# Altium project STM32F103.PRJPCB
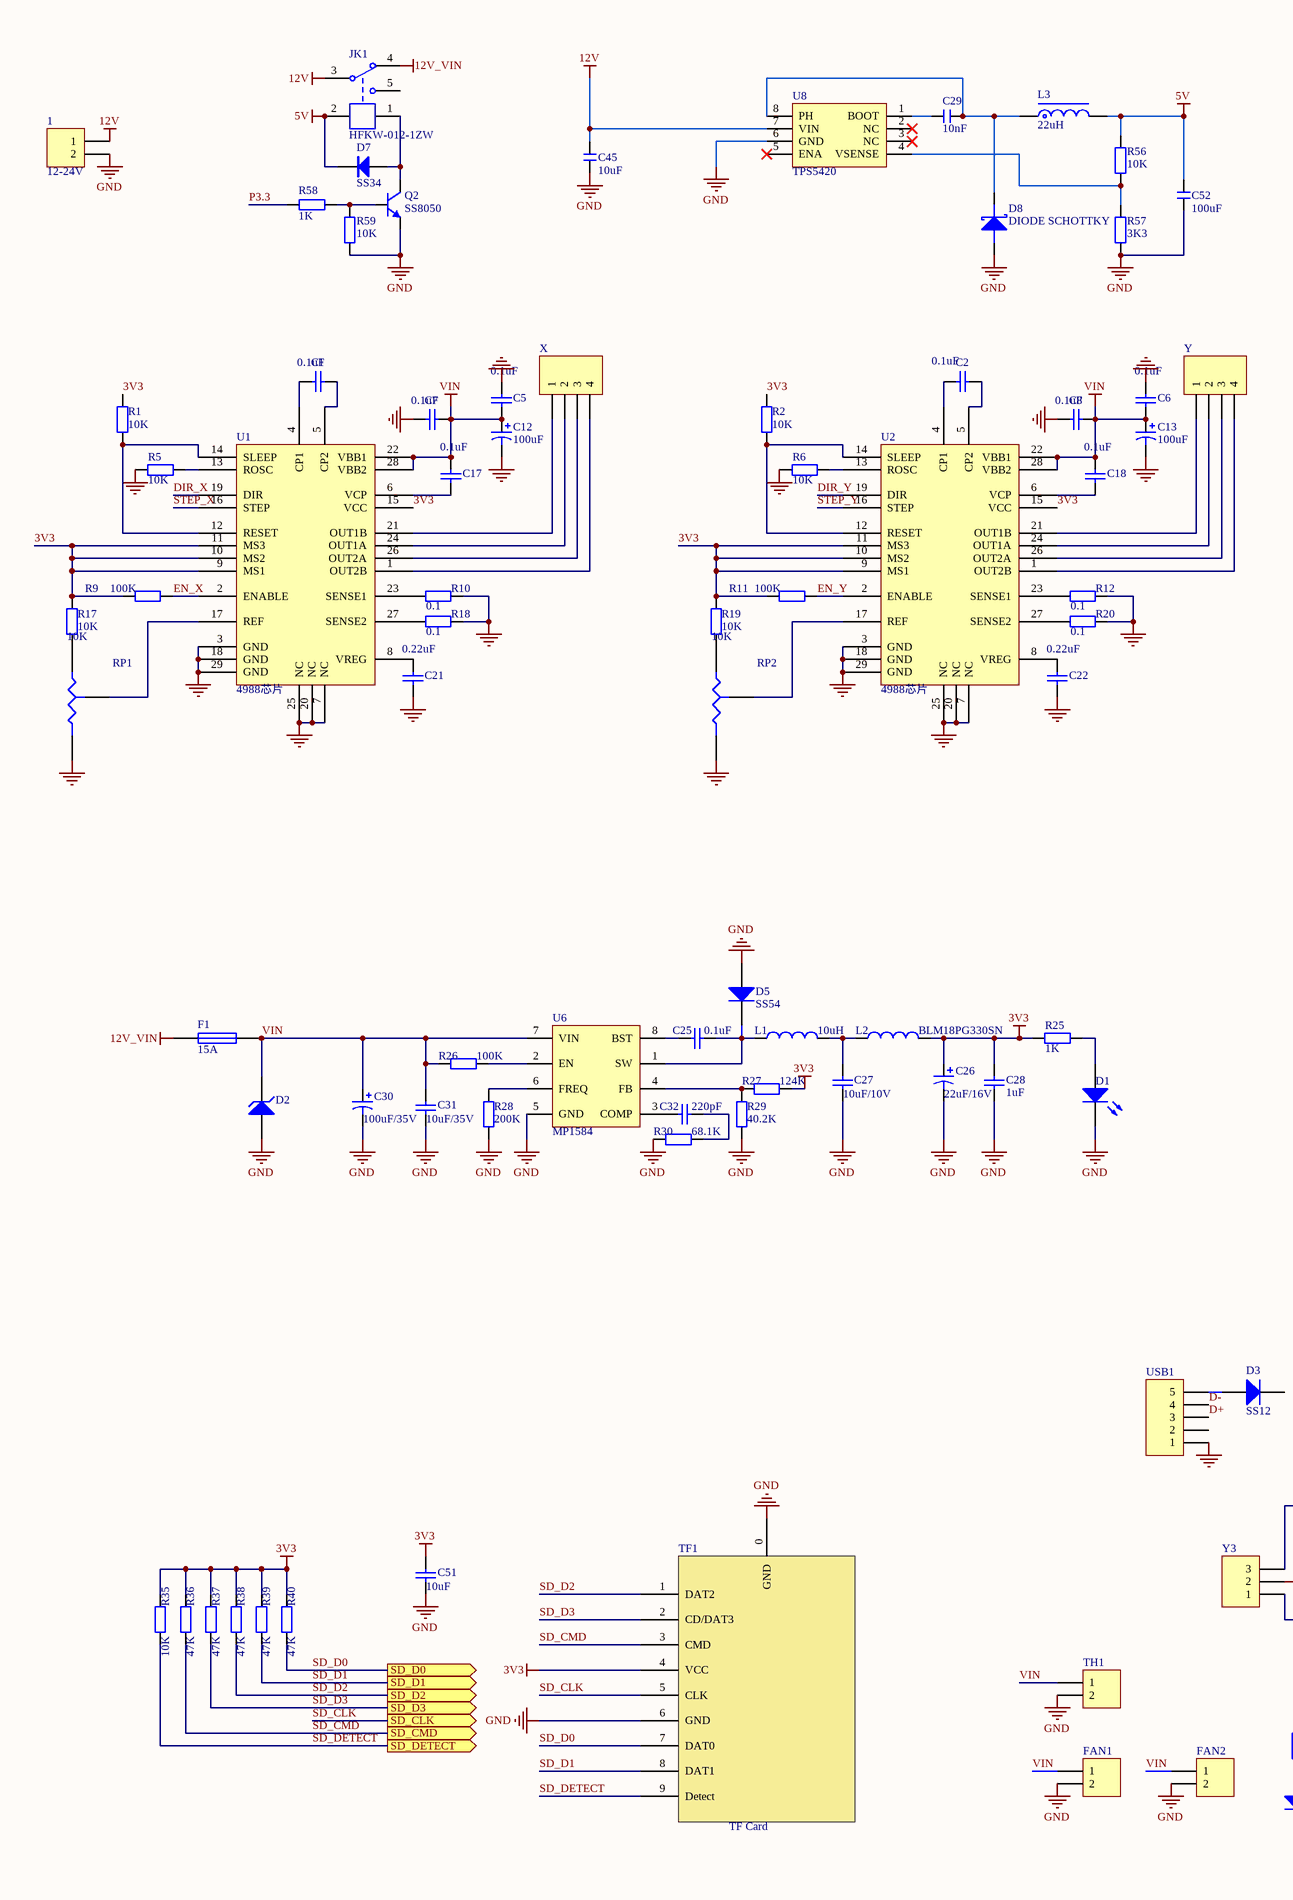
[diagram p0: STM32F103.SCHDOC, left]
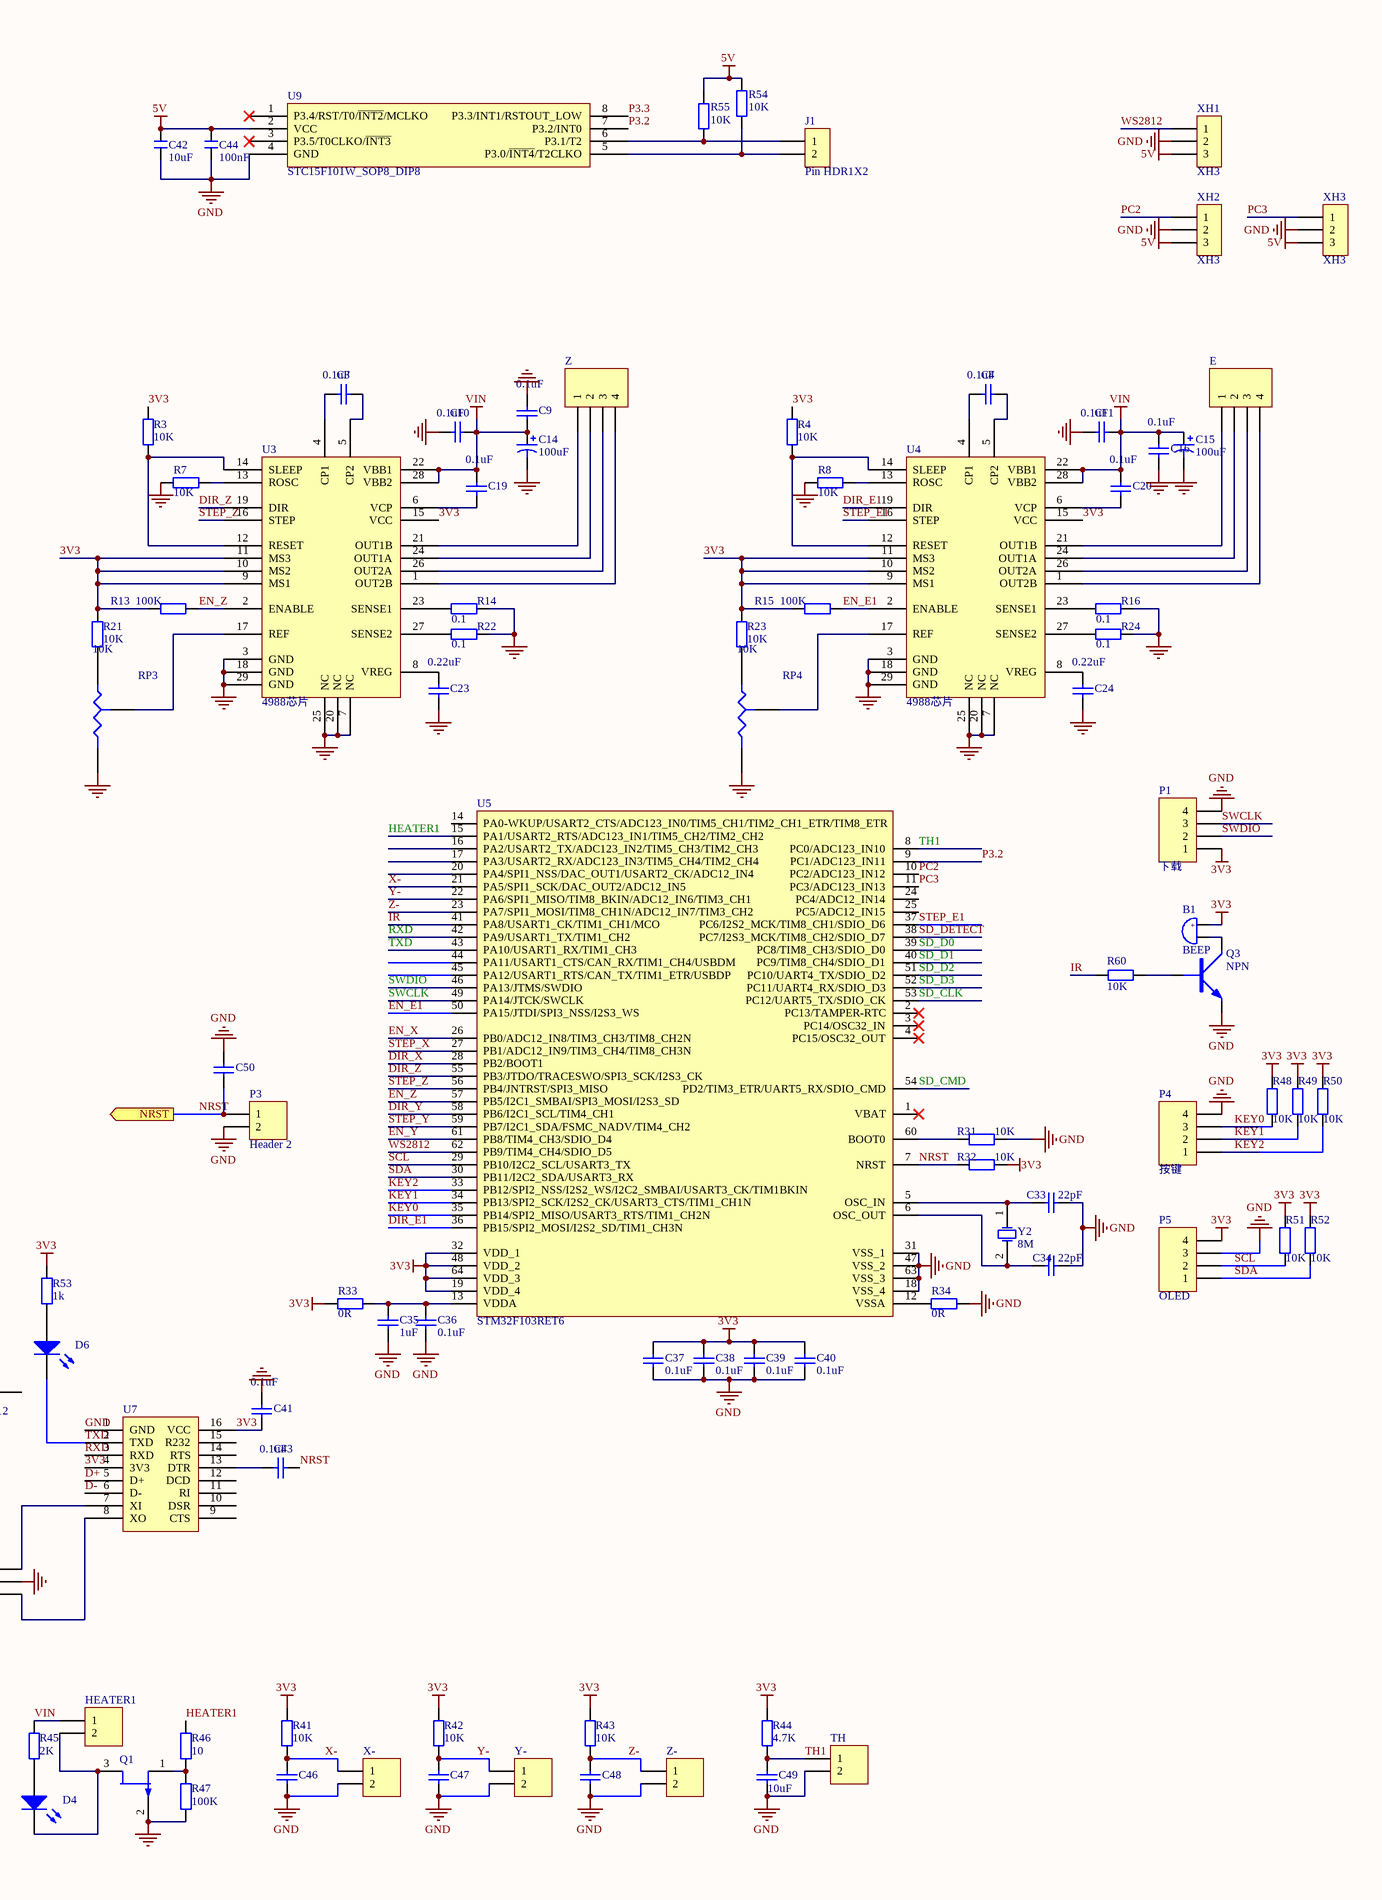
[diagram p1: STM32F103.SCHDOC, right]
1 sheet, 167 parts. Net scope: flat (ports and power ports of the same name join across sheets).
Board file: STM32F103RET6.PcbDoc

## Sheet STM32F103.SCHDOC: Motor
size A2

### Parts
1  12-24V  [VH-2P]
B1  BEEP  [BEEP 5x9x5.5]
C1  value 0.1uF  [0603]  (hidden comment: Cap)
C2  value 0.1uF  [0603]  (hidden comment: Cap)
C3  value 0.1uF  [0603]  (hidden comment: Cap)
C4  value 0.1uF  [0603]  (hidden comment: Cap)
C5  value 0.1uF  [0603]  (hidden comment: Cap)
C6  value 0.1uF  [0603]  (hidden comment: Cap)
C7  value 0.1uF  [0603]  (hidden comment: Cap)
C8  value 0.1uF  [0603]  (hidden comment: Cap)
C9  value 0.1uF  [0603]  (hidden comment: Cap)
C10  value 0.1uF  [0603]  (hidden comment: Cap)
C11  value 0.1uF  [0603]  (hidden comment: Cap)
C12  value 100uF  [电容100nf35V]  (hidden comment: Cap Pol1)
C13  value 100uF  [电容100nf35V]  (hidden comment: Cap Pol1)
C14  value 100uF  [电容100nf35V]  (hidden comment: Cap Pol1)
C15  value 100uF  [电容100nf35V]  (hidden comment: Cap Pol1)
C16  value 0.1uF  [0603]  (hidden comment: Cap)
C17  value 0.1uF  [0603]  (hidden comment: Cap)
C18  value 0.1uF  [0603]  (hidden comment: Cap)
C19  value 0.1uF  [0603]  (hidden comment: Cap)
C20  value 0.1uF  [0603]  (hidden comment: Cap)
C21  value 0.22uF  [0603]  (hidden comment: Cap)
C22  value 0.22uF  [0603]  (hidden comment: Cap)
C23  value 0.22uF  [0603]  (hidden comment: Cap)
C24  value 0.22uF  [0603]  (hidden comment: Cap)
C25  value 0.1uF  [0603]  (hidden comment: Cap)
C26  value 22uF/16V  [TAN-A]  (hidden comment: Cap Pol1)
C27  value 10uF/10V  [0805]  (hidden comment: Cap)
C28  value 1uF  [0603]  (hidden comment: Cap)
C29  10nF  [C 0603_L]
C30  value 100uF/35V  [电容100nf35V]  (hidden comment: Cap Pol1)
C31  value 10uF/35V  [0805]  (hidden comment: Cap)
C32  value 220pF  [0603]  (hidden comment: Cap)
C33  value 22pF  [0603]  (hidden comment: Cap)
C34  value 22pF  [0603]  (hidden comment: Cap)
C35  value 1uF  [0603]  (hidden comment: Cap)
C36  value 0.1uF  [0603]  (hidden comment: Cap)
C37  value 0.1uF  [0603]  (hidden comment: Cap)
C38  value 0.1uF  [0603]  (hidden comment: Cap)
C39  value 0.1uF  [0603]  (hidden comment: Cap)
C40  value 0.1uF  [0603]  (hidden comment: Cap)
C41  value 0.1uF  [0603]  (hidden comment: Cap)
C42  10uF  [C 0603_L]
C43  value 0.1uF  [0603]  (hidden comment: Cap)
C44  100nF  [C 0603_L]
C45  10uF  [C 0603_L]
C46  Cap  [0603]  (value not drawn)
C47  Cap  [0603]  (value not drawn)
C48  Cap  [0603]  (value not drawn)
C49  value 10uF  [0805]  (hidden comment: Cap)
C50  Cap  [0603]  (value not drawn)
C51  value 10uF  [0805]  (hidden comment: Cap)
C52  100uF  [C 0805_L]
D1  LED1  [LED-0603贴片]  (value not drawn)
D2  SMAJ33A  [SMA - duplicate]  (value not drawn)
D3  SS12  [SMA - duplicate]
D4  LED2  [LED-0603贴片]  (value not drawn)
D5  SS54  [SMA - duplicate]
D6  LED2  [LED-0603贴片]  (value not drawn)
D7  SS34  [SMB]
D8  DIODE SCHOTTKY  [SOD-123]
E  MHDR1X4  [2.54mm4pin]  (value not drawn)
F1  15A  [1206]
FAN1  Header 2  [2.54mm2pin]  (value not drawn)
FAN2  Header 2  [2.54mm2pin]  (value not drawn)
HEATER1  Header 2  [VH-2P]  (value not drawn)
J1  Pin HDR1X2  [Pin HDR1X2/2.54mm-S]
JK1  HFKW-012-1ZW  [012-1ZW_W]
L1  value 10uH  [5*5mm]  (hidden comment: Inductor)
L2  value BLM18PG330SN  [0603]  (hidden comment: Inductor)
L3  22uH  [CD54]
P1  下载  [HDR1X4]
P3  Header 2  [HDR1X2]
P4  按键  [2.54mm4pin]
P5  OLED  [2.54mm4pin]
Q1  JFET-P  [加热控制]  (value not drawn)
Q2  SS8050  [SOT23-3N]
Q3  NPN  [SOT-23]
R1  value 10K  [0603]  (hidden comment: Res2)
R2  value 10K  [0603]  (hidden comment: Res2)
R3  value 10K  [0603]  (hidden comment: Res2)
R4  value 10K  [0603]  (hidden comment: Res2)
R5  value 10K  [0603]  (hidden comment: Res2)
R6  value 10K  [0603]  (hidden comment: Res2)
R7  value 10K  [0603]  (hidden comment: Res2)
R8  value 10K  [0603]  (hidden comment: Res2)
R9  value 100K  [0603]  (hidden comment: Res2)
R10  value 0.1  [0805]  (hidden comment: Res2)
R11  value 100K  [0603]  (hidden comment: Res2)
R12  value 0.1  [0805]  (hidden comment: Res2)
R13  value 100K  [0603]  (hidden comment: Res2)
R14  value 0.1  [0805]  (hidden comment: Res2)
R15  value 100K  [0603]  (hidden comment: Res2)
R16  value 0.1  [0805]  (hidden comment: Res2)
R17  value 10K  [0603]  (hidden comment: Res2)
R18  value 0.1  [0805]  (hidden comment: Res2)
R19  value 10K  [0603]  (hidden comment: Res2)
R20  value 0.1  [0805]  (hidden comment: Res2)
R21  value 10K  [0603]  (hidden comment: Res2)
R22  value 0.1  [0805]  (hidden comment: Res2)
R23  value 10K  [0603]  (hidden comment: Res2)
R24  value 0.1  [0805]  (hidden comment: Res2)
R25  value 1K  [0603]  (hidden comment: Res2)
R26  value 100K  [0603]  (hidden comment: Res2)
R27  value 124K  [0603]  (hidden comment: Res2)
R28  value 200K  [0603]  (hidden comment: Res2)
R29  value 40.2K  [0603]  (hidden comment: Res2)
R30  value 68.1K  [0603]  (hidden comment: Res2)
R31  value 10K  [0603]  (hidden comment: Res2)
R32  value 10K  [0603]  (hidden comment: Res2)
R33  value 0R  [0603]  (hidden comment: Res2)
R34  value 0R  [0603]  (hidden comment: Res2)
R35  value 10K  [0603]  (hidden comment: Res2)
R36  value 47K  [0603]  (hidden comment: Res2)
R37  value 47K  [0603]  (hidden comment: Res2)
R38  value 47K  [0603]  (hidden comment: Res2)
R39  value 47K  [0603]  (hidden comment: Res2)
R40  value 47K  [0603]  (hidden comment: Res2)
R41  value 10K  [0603]  (hidden comment: Res2)
R42  value 10K  [0603]  (hidden comment: Res2)
R43  value 10K  [0603]  (hidden comment: Res2)
R44  value 4.7K  [0603]  (hidden comment: Res2)
R45  value 2K  [0603]  (hidden comment: Res2)
R46  value 10  [0603]  (hidden comment: Res2)
R47  value 100K  [0603]  (hidden comment: Res2)
R48  value 10K  [0603]  (hidden comment: Res2)
R49  value 10K  [0603]  (hidden comment: Res2)
R50  value 10K  [0603]  (hidden comment: Res2)
R51  value 10K  [0603]  (hidden comment: Res2)
R52  value 10K  [0603]  (hidden comment: Res2)
R53  value 1k  [0603]  (hidden comment: Res2)
R54  10K  [R 0603_L]
R55  10K  [R 0603_L]
R56  10K  [R 0603_L]
R57  3K3  [R 0603_M]
R58  1K  [R 0603_L]
R59  10K  [R 0603_L]
R60  10K  [R 0603_L]
RP1  value 10K  [贴片可调电阻]  (hidden comment: Res Tap)
RP2  value 10K  [贴片可调电阻]  (hidden comment: Res Tap)
RP3  value 10K  [贴片可调电阻]  (hidden comment: Res Tap)
RP4  value 10K  [贴片可调电阻]  (hidden comment: Res Tap)
TF1  TF Card  [TF Card]
TH  Header 2  [2.54mm2pin]  (value not drawn)
TH1  Header 2  [2.54mm2pin]  (value not drawn)
U1  4988芯片  [4988芯片]
U2  4988芯片  [4988芯片]
U3  4988芯片  [4988芯片]
U4  4988芯片  [4988芯片]
U5  STM32F103RET6  [LQFP-64]
U6  MP1584  [SOP8+1]
U7  CH340G  [MSOP-16]  (value not drawn)
U8  TPS5420  [SOP8_M]
U9  STC15F101W_SOP8_DIP8  [SOP8]
USB1  Header 5  [USB接口]  (value not drawn)
X  MHDR1X4  [2.54mm4pin]  (value not drawn)
X-  Header 2  [2.54mm2pin]  (value not drawn)
XH1  XH3  [XH3/2.54mm/180]
XH2  XH3  [XH3/2.54mm/180]
XH3  XH3  [XH3/2.54mm/180]
Y  MHDR1X4  [2.54mm4pin]  (value not drawn)
Y2  8M  [5032-2P]
Y3  Header 3H  [三脚晶振]  (value not drawn)
Y-  Header 2  [2.54mm2pin]  (value not drawn)
Z  MHDR1X4  [2.54mm4pin]  (value not drawn)
Z-  Header 2  [2.54mm2pin]  (value not drawn)

### Ports
NRST (out), SD_CLK (out), SD_CMD (out), SD_D0 (out), SD_D1 (out), SD_D2 (out), SD_D3 (out), SD_DETECT (out)

### Nets
3V3: B1.1 C26.1 C28.1 C37.1 C38.1 C39.1 C40.1 C41.1 C51.2 L2.2 P1.1 P5.4 R1.2 R2.2 R3.2 R4.2 R9.2 R11.2 R13.2 R15.2 R17.1 R19.1 R21.1 R23.1 R25.2 R27.2 R32.2 R33.2 R35.1 R36.1 R37.1 R38.1 R39.1 R40.1 R41.2 R42.2 R43.2 R44.1 R48.2 R49.2 R50.2 R51.2 R52.2 R53.1 TF1.4(VCC) U1.9(MS1) U1.10(MS2) U1.11(MS3) U1.15(VCC) U2.9(MS1) U2.10(MS2) U2.11(MS3) U2.15(VCC) U3.9(MS1) U3.10(MS2) U3.11(MS3) U3.15(VCC) U4.9(MS1) U4.10(MS2) U4.11(MS3) U4.15(VCC) U5.19(VDD_4) U5.32(VDD_1) U5.48(VDD_2) U5.64(VDD_3) U7.4(3V3) U7.16(VCC)
5V: C42.2 C44.2 C52.2 D7.2(K) JK1.2 L3.2 R54.2 R55.2 R56.2 U9.2(VCC) XH1.3 XH2.3 XH3.3
12V: 1.1 C45.2 JK1.3 U8.7(VIN)
12V_VIN: F1.1 JK1.4
GND: 1.2 C5.2 C6.2 C7.2 C8.2 C9.2 C10.2 C11.2 C12.2 C13.2 C14.2 C15.2 C16.2 C21.2 C22.2 C23.2 C24.2 C26.2 C27.2 C28.2 C30.2 C31.2 C33.1 C34.1 C35.2 C36.2 C37.2 C38.2 C39.2 C40.2 C41.2 C42.1 C44.1 C45.1 C46.1 C47.1 C48.1 C49.1 C50.2 C51.1 C52.1 D1.2(K) D2.1(A) D5.1(A) D8.A FAN1.2 FAN2.2 P1.4 P3.2 P4.4 P5.3 Q1.2(G) Q2.2(E) Q3.E R5.2 R6.2 R7.2 R8.2 R10.2 R12.2 R14.2 R16.2 R18.2 R20.2 R22.2 R24.2 R28.1 R29.1 R30.2 R31.2 R34.1 R47.2 R57.1 R59.1 RP1.2 RP2.2 RP3.2 RP4.2 TF1.0(GND) TF1.6(GND) TH.2 TH1.2 U1.3(GND) U1.7(NC) U1.18(GND) U1.20(NC) U1.25(NC) U1.29(GND) U2.3(GND) U2.7(NC) U2.18(GND) U2.20(NC) U2.25(NC) U2.29(GND) U3.3(GND) U3.7(NC) U3.18(GND) U3.20(NC) U3.25(NC) U3.29(GND) U4.3(GND) U4.7(NC) U4.18(GND) U4.20(NC) U4.25(NC) U4.29(GND) U5.18(VSS_4) U5.31(VSS_1) U5.47(VSS_2) U5.63(VSS_3) U6.5(GND) U7.1(GND) U8.6(GND) U9.4(GND) USB1.1 X-.2 XH1.2 XH2.2 XH3.2 Y3.2 Y-.2 Z-.2
VIN: C5.1 C6.1 C7.1 C8.1 C9.1 C10.1 C11.1 C12.1 C13.1 C14.1 C15.1 C16.1 C17.1 C18.1 C19.1 C20.1 C30.1 C31.1 D2.2(K) F1.2 FAN1.1 FAN2.1 HEATER1.1 R26.1 R45.1 TH1.1 U1.22(VBB1) U1.28(VBB2) U2.22(VBB1) U2.28(VBB2) U3.22(VBB1) U3.28(VBB2) U4.22(VBB1) U4.28(VBB2) U6.7(VIN)
D+: U7.5(D+) USB1.3
D-: U7.6(D-) USB1.4
DIR_E1: U4.19(DIR) U5.36(PB15/SPI2_MOSI/I2S2_SD/TIM1_CH3N)
DIR_X: U1.19(DIR) U5.28(PB2/BOOT1)
DIR_Y: U2.19(DIR) U5.58(PB6/I2C1_SCL/TIM4_CH1)
DIR_Z: U3.19(DIR) U5.55(PB3/JTDO/TRACESWO/SPI3_SCK/I2S3_CK)
EN_E1: R15.1 U4.2(ENABLE) U5.50(PA15/JTDI/SPI3_NSS/I2S3_WS)
EN_X: R9.1 U1.2(ENABLE) U5.26(PB0/ADC12_IN8/TIM3_CH3/TIM8_CH2N)
EN_Y: R11.1 U2.2(ENABLE) U5.61(PB8/TIM4_CH3/SDIO_D4)
EN_Z: R13.1 U3.2(ENABLE) U5.57(PB5/I2C1_SMBAI/SPI3_MOSI/I2S3_SD)
HEATER1: R46.1 U5.15(PA1/USART2_RTS/ADC123_IN1/TIM5_CH2/TIM2_CH2)
IR: R60.2 U5.41(PA8/USART1_CK/TIM1_CH1/MCO)
KEY0: P4.3 R48.1 U5.35(PB14/SPI2_MISO/USART3_RTS/TIM1_CH2N)
KEY1: P4.2 R49.1 U5.34(PB13/SPI2_SCK/I2S2_CK/USART3_CTS/TIM1_CH1N)
KEY2: P4.1 R50.1 U5.33(PB12/SPI2_NSS/I2S2_WS/I2C2_SMBAI/USART3_CK/TIM1BKIN)
NRST: C43.1 C50.1 P3.1 R32.1 U5.7(NRST) ; port NRST
P3.2: U5.9(PC1/ADC123_IN11) U9.7(P3.2/INT0)
P3.3: R58.2 U9.8(P3.3/INT1/RSTOUT_LOW)
PC2: U5.10(PC2/ADC123_IN12) XH2.1
PC3: U5.11(PC3/ADC123_IN13) XH3.1
RXD: U5.42(PA9/USART1_TX/TIM1_CH2) U7.3(RXD)
SCL: P5.2 R51.1 U5.29(PB10/I2C2_SCL/USART3_TX)
SD_CLK: TF1.5(CLK) U5.53(PC12/UART5_TX/SDIO_CK) ; port SD_CLK
SD_CMD: R36.2 TF1.3(CMD) U5.54(PD2/TIM3_ETR/UART5_RX/SDIO_CMD) ; port SD_CMD
SD_D0: R40.2 TF1.7(DAT0) U5.39(PC8/TIM8_CH3/SDIO_D0) ; port SD_D0
SD_D1: R39.2 TF1.8(DAT1) U5.40(PC9/TIM8_CH4/SDIO_D1) ; port SD_D1
SD_D2: R38.2 TF1.1(DAT2) U5.51(PC10/UART4_TX/SDIO_D2) ; port SD_D2
SD_D3: R37.2 TF1.2(CD/DAT3) U5.52(PC11/UART4_RX/SDIO_D3) ; port SD_D3
SD_DETECT: R35.2 TF1.9(Detect) U5.38(PC7/I2S3_MCK/TIM8_CH2/SDIO_D7) ; port SD_DETECT
SDA: P5.1 R52.1 U5.30(PB11/I2C2_SDA/USART3_RX)
STEP_E1: U4.16(STEP) U5.37(PC6/I2S2_MCK/TIM8_CH1/SDIO_D6)
STEP_X: U1.16(STEP) U5.27(PB1/ADC12_IN9/TIM3_CH4/TIM8_CH3N)
STEP_Y: U2.16(STEP) U5.59(PB7/I2C1_SDA/FSMC_NADV/TIM4_CH2)
STEP_Z: U3.16(STEP) U5.56(PB4/JNTRST/SPI3_MISO)
SWCLK: P1.3 U5.49(PA14/JTCK/SWCLK)
SWDIO: P1.2 U5.46(PA13/JTMS/SWDIO)
TH1: C49.2 R44.2 TH.1 U5.8(PC0/ADC123_IN10)
TXD: D6.2(K) U5.43(PA10/USART1_RX/TIM1_CH3) U7.2(TXD)
WS2812: U5.62(PB9/TIM4_CH4/SDIO_D5) XH1.1
X-: C46.2 R41.1 U5.21(PA5/SPI1_SCK/DAC_OUT2/ADC12_IN5) X-.1
Y-: C47.2 R42.1 U5.22(PA6/SPI1_MISO/TIM8_BKIN/ADC12_IN6/TIM3_CH1) Y-.1
Z-: C48.2 R43.1 U5.23(PA7/SPI1_MOSI/TIM8_CH1N/ADC12_IN7/TIM3_CH2) Z-.1
NetB1_2: B1.2 Q3.C
NetC1_1: C1.1 U1.4(CP1)
NetC1_2: C1.2 U1.5(CP2)
NetC2_1: C2.1 U2.4(CP1)
NetC2_2: C2.2 U2.5(CP2)
NetC3_1: C3.1 U3.4(CP1)
NetC3_2: C3.2 U3.5(CP2)
NetC4_1: C4.1 U4.4(CP1)
NetC4_2: C4.2 U4.5(CP2)
NetC17_2: C17.2 U1.6(VCP)
NetC18_2: C18.2 U2.6(VCP)
NetC19_2: C19.2 U3.6(VCP)
NetC20_2: C20.2 U4.6(VCP)
NetC21_1: C21.1 U1.8(VREG)
NetC22_1: C22.1 U2.8(VREG)
NetC23_1: C23.1 U3.8(VREG)
NetC24_1: C24.1 U4.8(VREG)
NetC25_1: C25.1 D5.2(K) L1.1 U6.1(SW)
NetC25_2: C25.2 U6.8(BST)
NetC27_1: C27.1 L1.2 L2.1
NetC29_1: C29.1 D8.K L3.1 U8.8(PH)
NetC29_2: C29.2 U8.1(BOOT)
NetC32_1: C32.1 U6.3(COMP)
NetC32_2: C32.2 R30.1
NetC33_2: C33.2 U5.5(OSC_IN) Y2.1(OSC2)
NetC34_2: C34.2 U5.6(OSC_OUT) Y2.2(OSC1)
NetC35_1: C35.1 C36.1 R33.1 U5.13(VDDA)
NetC43_2: C43.2 U7.13(DTR)
NetD1_1: D1.1(A) R25.1
NetD3_1: D3.1(A) USB1.5
NetD4_1: D4.1(A) R45.2
NetD4_2: D4.2(K) HEATER1.2 Q1.3(S)
NetD6_1: D6.1(A) R53.2
NetD7_1: D7.1(A) JK1.1 Q2.3(C)
NetE_1: E.1 U4.21(OUT1B)
NetE_2: E.2 U4.24(OUT1A)
NetE_3: E.3 U4.26(OUT2A)
NetE_4: E.4 U4.1(OUT2B)
NetJ1_1: J1.1 R55.1 U9.6(P3.1/T2)
NetJ1_2: J1.2 R54.1 U9.5(P3.0/~{INT4}/T2CLKO)
NetQ1_1: Q1.1(D) R46.2 R47.1
NetQ2_1: Q2.1(B) R58.1 R59.2
NetQ3_B: Q3.B R60.1
NetR1_1: R1.1 U1.12(RESET) U1.14(SLEEP)
NetR2_1: R2.1 U2.12(RESET) U2.14(SLEEP)
NetR3_1: R3.1 U3.12(RESET) U3.14(SLEEP)
NetR4_1: R4.1 U4.12(RESET) U4.14(SLEEP)
NetR5_1: R5.1 U1.13(ROSC)
NetR6_1: R6.1 U2.13(ROSC)
NetR7_1: R7.1 U3.13(ROSC)
NetR8_1: R8.1 U4.13(ROSC)
NetR10_1: R10.1 U1.23(SENSE1)
NetR12_1: R12.1 U2.23(SENSE1)
NetR14_1: R14.1 U3.23(SENSE1)
NetR16_1: R16.1 U4.23(SENSE1)
NetR17_2: R17.2 RP1.3
NetR18_1: R18.1 U1.27(SENSE2)
NetR19_2: R19.2 RP2.3
NetR20_1: R20.1 U2.27(SENSE2)
NetR21_2: R21.2 RP3.3
NetR22_1: R22.1 U3.27(SENSE2)
NetR23_2: R23.2 RP4.3
NetR24_1: R24.1 U4.27(SENSE2)
NetR26_2: R26.2 U6.2(EN)
NetR27_1: R27.1 R29.2 U6.4(FB)
NetR28_2: R28.2 U6.6(FREQ)
NetR31_1: R31.1 U5.60(BOOT0)
NetR34_2: R34.2 U5.12(VSSA)
NetR56_1: R56.1 R57.2 U8.4(VSENSE)
NetRP1_1: RP1.1 U1.17(REF)
NetRP2_1: RP2.1 U2.17(REF)
NetRP3_1: RP3.1 U3.17(REF)
NetRP4_1: RP4.1 U4.17(REF)
NetU1_1: U1.1(OUT2B) X.4
NetU1_21: U1.21(OUT1B) X.1
NetU1_24: U1.24(OUT1A) X.2
NetU1_26: U1.26(OUT2A) X.3
NetU2_1: U2.1(OUT2B) Y.4
NetU2_21: U2.21(OUT1B) Y.1
NetU2_24: U2.24(OUT1A) Y.2
NetU2_26: U2.26(OUT2A) Y.3
NetU3_1: U3.1(OUT2B) Z.4
NetU3_21: U3.21(OUT1B) Z.1
NetU3_24: U3.24(OUT1A) Z.2
NetU3_26: U3.26(OUT2A) Z.3
NetU7_7: U7.7(XI) Y3.3
NetU7_8: U7.8(XO) Y3.1

Not connected (* = marked no-connect by the designer): D3 2(K); JK1 5; U5 1(VBAT)* 2(PC13/TAMPER-RTC)* 3(PC14/OSC32_IN)* 4(PC15/OSC32_OUT)* 14(PA0-WKUP/USART2_CTS/ADC123_IN0/TIM5_CH1/TIM2_CH1_ETR/TIM8_ETR) 16(PA2/USART2_TX/ADC123_IN2/TIM5_CH3/TIM2_CH3) 17(PA3/USART2_RX/ADC123_IN3/TIM5_CH4/TIM2_CH4) 20(PA4/SPI1_NSS/DAC_OUT1/USART2_CK/ADC12_IN4) 24(PC4/ADC12_IN14) 25(PC5/ADC12_IN15) 44(PA11/USART1_CTS/CAN_RX/TIM1_CH4/USBDM) 45(PA12/USART1_RTS/CAN_TX/TIM1_ETR/USBDP); U7 9(CTS) 10(DSR) 11(RI) 12(DCD) 14(RTS) 15(R232); U8 2(NC)* 3(NC)* 5(ENA)*; U9 1(P3.4/RST/T0/~{INT2}/MCLKO)* 3(P3.5/T0CLKO/~{INT3})*; USB1 2

### Notes on the sheet
- (in symbol BEEP) +

### Library data of the parts
1 FAN1 FAN2 HEATER1 P3 TH TH1 X- Y- Z- = Header 2: Header, 2-Pin; LatestRevisionDate: 17-Jul-2002; LatestRevisionNote: Re-released for DXP Platform.; Publisher: Altium Limited
B1 = BEEP: 蜂鸣器
C1-C11 C16-C25 C27 C28 C31-C41 C43 C49 C51 = Cap: Capacitor; Published: 8-Jun-2000; LatestRevisionDate: 17-Jul-2002; LatestRevisionNote: Re-released for DXP Platform.; PackageReference: RAD-0.3; Publisher: Altium Limited
  C25 C27 C28 C31-C40: PackageDescription: Radial Cap, Thru-Hole; 2 Leads; 0.3 in Pin Spacing
C12-C15 C26 C30 = Cap Pol1: Polarized Capacitor (Radial); Published: 8-Jun-2000; LatestRevisionDate: 17-Jul-2002; LatestRevisionNote: Re-released for DXP Platform.; PackageReference: RB7.6-15; Publisher: Altium Limited
  C26 C30: PackageDescription: Polarized Capacitor (Radial); 2 Leads
C29 C42 C44 C45 C52 = C: 无极性贴片电容
C46-C48 C50 = Cap: Capacitor; Value: 0.1uF; Published: 8-Jun-2000; LatestRevisionDate: 17-Jul-2002; LatestRevisionNote: Re-released for DXP Platform.; PackageReference: RAD-0.3; Publisher: Altium Limited
D1 = LED1: Typical RED GaAs LED; Published: 8-Jun-2000; LatestRevisionDate: 08-Jul-2005; LatestRevisionNote: Mech Layer 1 removed.; PackageReference: LED-1; Publisher: Altium Limited
D2 = D Zener: Zener Diode; Published: 8-Jun-2000; LatestRevisionDate: 17-Jul-2002; LatestRevisionNote: Re-released for DXP Platform.; PackageReference: DIODE-0.7; Publisher: Altium Limited
D3 = Diode 1N914: High Conductance Fast Diode; Published: 8-Jun-2000; LatestRevisionDate: 17-Jul-2002; LatestRevisionNote: Re-released for DXP Platform.; DatasheetDocument: 1997; PackageReference: DO-35; Publisher: Altium Limited; Code_JEDEC: DO-204-AH; ComponentLink1Description: Manufacturer Link; ComponentLink1URL: http://www.fairchildsemi.com/; ComponentLink2Description: Datasheet; ComponentLink2URL: http://www.fairchildsemi.com/ds/1N%2F1N4448.pdf
D4 D6 = LED2: Typical RED, GREEN, YELLOW, AMBER GaAs LED; Published: 8-Jun-2000; LatestRevisionDate: 17-Jul-2002; LatestRevisionNote: Re-released for DXP Platform.; PackageDocument: Feb-2002; PackageReference: 3.2X1.6X1.1; Publisher: Altium Limited
D5 = Diode 1N4001: 1 Amp General Purpose Rectifier; Published: 8-Jun-2000; LatestRevisionDate: 17-Jul-2002; LatestRevisionNote: Re-released for DXP Platform.; DatasheetDocument: 1998; PackageDocument: Aug-1999; PackageReference: DO-41; Publisher: Altium Limited; Code_JEDEC: DO-204-AL; ComponentLink1Description: Manufacturer Link; ComponentLink1URL: http://www.fairchildsemi.com/; ComponentLink2Description: Datasheet; ComponentLink2URL: http://www.fairchildsemi.com/ds/1N%2F1N4001.pdf
D7 = SS24: 肖特基二极管; 版权归属: 源创客; 属性: 40V/2A; BOM名称: 肖特基二极管; 学习资源: www.ooocke.com
D8 = DIODE SCHOTTKY: 肖特基二极管
E X Y Z = MHDR1X4: Header, 4-Pin; LatestRevisionDate: 17-Jul-2002; LatestRevisionNote: Re-released for DXP Platform.; Publisher: Altium Limited
F1 = Fuse 1: Fuse; Published: 8-Jun-2000; LatestRevisionDate: 17-Jul-2002; LatestRevisionNote: Re-released for DXP Platform.; PackageReference: PIN-W2/E2.8; Publisher: Altium Limited; PackageDescription: Thru-Hole; 2 Leads
JK1 = HFKW-012-1ZW: 12V一组转换; BOM名称: 12V继电器; 版权归属: 源创客; 学习资源: www.ooocke.com
L1 L2 = Inductor: Code_IEC: 1005; Published: 8-Jun-2000; LatestRevisionDate: 29-May-2009; LatestRevisionNote: IPC-7351 Footprint Added.; PackageReference: 0402-A; Publisher: Altium Limited; PackageDescription: Chip Inductor; Code_JEITA: 0402
L3 = L-CD: 贴片功率电感; BOM名称: 功率电感; 版权归属: 源创客; 学习资源: www.ooocke.com
P1 P4 P5 = Header 4: Header, 4-Pin; LatestRevisionDate: 17-Jul-2002; LatestRevisionNote: Re-released for DXP Platform.; Publisher: Altium Limited
Q1 = JFET-P: P-Channel JFET; Published: 8-Jun-2000; LatestRevisionDate: 17-Jul-2002; LatestRevisionNote: Re-released for DXP Platform.; PackageReference: TO-18A; Publisher: Altium Limited
Q2 = 8050-SMD: 高频放大-NPN型; 版权归属: 源创客; 属性: 40V 1.5A 1W 100MHZ; BOM名称: 高频放大-NPN型; 学习资源: www.ooocke.com
Q3 = NPN: NPN三极管
R1-R53 = Res2: Resistor; Published: 8-Jun-2000; LatestRevisionDate: 17-Jul-2002; LatestRevisionNote: Re-released for DXP Platform.; PackageReference: AXIAL-0.4; Publisher: Altium Limited
  R26-R34: PackageDescription: Axial Device, Thru-Hole; 2 Leads; 0.4 in Pin Spacing
R54-R60 = R: 贴片电阻; 版权归属: 源创客; BOM名称: 贴片电阻; 学习资源: www.ooocke.com
RP1-RP4 = Res Tap: Tapped Resistor; Sim Note: Enter the Resistance value and the set point into parameter fields.; Set Position: 0.5; Published: 24-Mar-1999; LatestRevisionDate: 17-Jul-2002; LatestRevisionNote: Re-released for DXP Platform.; PackageReference: VR3; Publisher: Altium Limited
U8 = TPS5420: 同步降压IC
USB1 = Header 5: Header, 5-Pin; LatestRevisionDate: 17-Jul-2002; LatestRevisionNote: Re-released for DXP Platform.; Publisher: Altium Limited
Y2 = XTAL: Crystal Oscillator; Published: 8-Jun-2000; LatestRevisionDate: 17-Jul-2002; LatestRevisionNote: Re-released for DXP Platform.; PackageReference: R38; Publisher: Altium Limited; PackageDescription: Crystal, Thru-Hole; 2 Leads; Body 3.1 x 8.2 mm (Dia.xH); ULR: https://item.taobao.com/item.htm?spm=a1z10.5-c.w4002-10568856869.43.xxhXLm&id=9156817334
Y3 = Header 3H: Header, 3-Pin, Right Angle; LatestRevisionDate: 17-Jul-2002; LatestRevisionNote: Re-released for DXP Platform.; Publisher: Altium Limited